# Altium schematic sheet ESP32.SchDoc
size A4
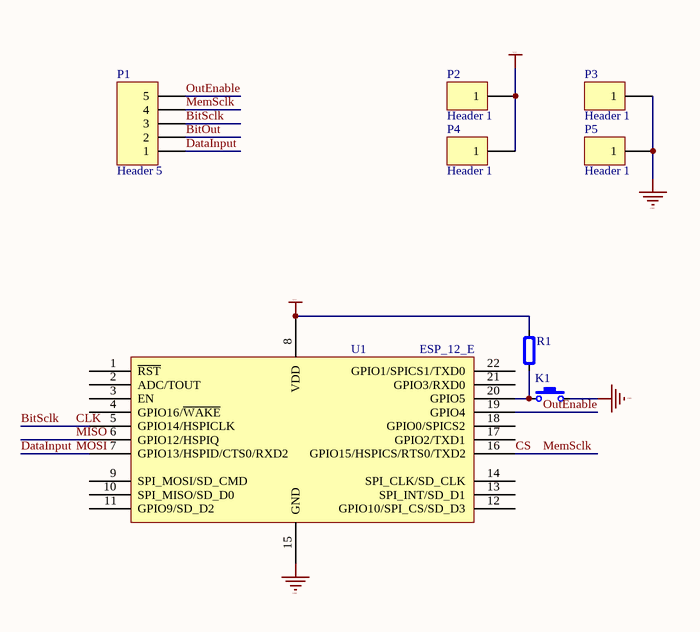
[diagram p0: ESP32.SchDoc]

## Parts
K1  TACT 2P  [ButtonTACT_3x6x2.5_180]  (value not drawn)
P1  Header 5  [HDR1X5_SOP]
P2  Header 1  [HDR1X1_SOP]
P3  Header 1  [HDR1X1_SOP]
P4  Header 1  [HDR1X1_SOP]
P5  Header 1  [HDR1X1_SOP]
R1  R0805  [RES_0805]  (value not drawn)
U1  ESP_12_E  [ESP_12_E]

## Nets
GND: K1.2 P3.1 P5.1 U1.15(GND)
VCC: P2.1 P4.1 R1.2 U1.8(VDD)
BitOut: P1.2
BitSclk: P1.3 U1.5(GPIO14/HSPICLK)  [also labelled CLK]
CS: P1.4 U1.16(GPIO15/HSPICS/RTS0/TXD2)  [also labelled MemSclk]
DataInput: P1.1 U1.7(GPIO13/HSPID/CTS0/RXD2)  [also labelled MOSI]
MISO: U1.6(GPIO12/HSPIQ)
OutEnable: P1.5 U1.19(GPIO4)
NetK1_1: K1.1 R1.1 U1.20(GPIO5)

Not connected (* = marked no-connect by the designer): U1 1(~{RST}) 2(ADC/TOUT) 3(EN) 4(GPIO16/~{WAKE}) 9(SPI_MOSI/SD_CMD) 10(SPI_MISO/SD_D0) 11(GPIO9/SD_D2) 12(GPIO10/SPI_CS/SD_D3) 13(SPI_INT/SD_D1) 14(SPI_CLK/SD_CLK) 17(GPIO2/TXD1) 18(GPIO0/SPICS2) 21(GPIO3/RXD0) 22(GPIO1/SPICS1/TXD0)

## Library data of the parts
K1 = ButtonTACT_3x6x2.5_180: Button; value: 3x6; type: TACT 2P
P1 = Header 5: Header, 5-Pin; LatestRevisionDate: 17-Jul-2002; LatestRevisionNote: Re-released for DXP Platform.; Publisher: Altium Limited
P2-P5 = Header 1: Header, 1-Pin; LatestRevisionDate: 17-Jul-2002; LatestRevisionNote: Re-released for DXP Platform.; Publisher: Altium Limited
R1 = Res_0805: Resistor; Specification: ±5%; Value: 10K; Manufacturer: *; Type: 0805
U1 = ESP_12_E: ESP-12 Wi-Fi Module by AI-Thinker; IC: ESP8266-EX; Vendor: Ai-thinker